# EAGLE design gerrit_lamp (EAGLE 8.7.1)
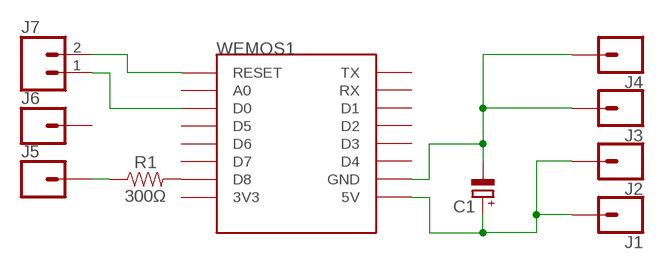
[diagram p0: schematic, sheet 1]

## Parts
C1  CPOL-EUE5-5  [E5-5]
J1  CONN_01PTH_NO_SILK_KIT  [1X01NS_KIT]
J2  CONN_01PTH_NO_SILK_KIT  [1X01NS_KIT]
J3  CONN_01PTH_NO_SILK_KIT  [1X01NS_KIT]
J4  CONN_01PTH_NO_SILK_KIT  [1X01NS_KIT]
J5  CONN_01PTH_NO_SILK_KIT  [1X01NS_KIT]
J6  CONN_01PTH_NO_SILK_KIT  [1X01NS_KIT]
J7  CONN_02  [1X02]
R1  300Ω  RESISTORAXIAL-0.3  [AXIAL-0.3]
WEMOS1  WEMOS-D1-MINI  [WEMOS-D1-MINI]

## Nets
D0: J7.1 WEMOS1.D0
GND: C1.- J3.1 J4.1 WEMOS1.GND
N$1: R1.P$2 WEMOS1.D8
N$6: J5.1 R1.P$1
RST: J7.2 WEMOS1.RESET
VCC: C1.+ J1.1 J2.1 WEMOS1.5V
Unconnected: J6.1 WEMOS1.3V3 WEMOS1.A0 WEMOS1.D1 WEMOS1.D2 WEMOS1.D3 WEMOS1.D4 WEMOS1.D5 WEMOS1.D6 WEMOS1.D7 WEMOS1.RX WEMOS1.TX

## Library data of the parts
C1 = rcl:CPOL-EU: POLARIZED CAPACITOR, European symbol; SPICEPREFIX: C
J1-J6 = SparkFun-Connectors:CONN_01: Single connection point. Often used as Generic Header-pin footprint for 0.1 inch spaced/style header connections On any of the 0.1 inch spaced packages, you can populate with these: Break Away Headers - Straight <https://www.sparkfun.com/products/116> (PRT-00116) Break Away Male Headers - Right Angle <https://www.sparkfun.com/products/553> (PRT-00553) Female Headers <https://www.sparkfun.com/products/115> (PRT-00115) Break Away Headers - Machine Pin <https://www.sparkfun.com/products/117> (PRT-00117) Break Away Female Headers - Swiss Machine Pin <https://www.sparkfun.com/products/743> (PRT-00743) This device is also useful as a general connection point to wire up your design to another part of your project. Our various solder wires solder well into these plated through hole pads. Hook-Up Wire - Assortment (Stranded, 22 AWG) <https://www.sparkfun.com/products/11375> (PRT-11375) Hook-Up Wire - Assortment (Solid Core, 22 AWG) <https://www.sparkfun.com/products/11367> (PRT-11367) View the entire wire category on our website here <https://www.sparkfun.com/categories/141> Special notes: SMTSO-256-ET is a "flush mount" nut for a 4-40 screw. We mostly use this on specialty testbeds; it is a nice way to connect hardware to your PCB at an adjustable hieght. Also note, the SNAP packages are for using a snappable style connector. We sell a baggie of snaps and they are also used on two LilyPad designs: Snap Assortment - 30 pack (male and female) <https://www.sparkfun.com/products/11347> (DEV-11347) LilyPad Arduino SimpleSnap <https://www.sparkfun.com/products/10941> (DEV-10941) LilyPad SimpleSnap Protoboard <https://www.sparkfun.com/products/10940> (DEV-10940)
J7 = SparkFun-Connectors:CONN_02: Multi connection point. Often used as Generic Header-pin footprint for 0.1 inch spaced/style header connections On any of the 0.1 inch spaced packages, you can populate with these: Break Away Headers - Straight <https://www.sparkfun.com/products/116> (PRT-00116) Break Away Male Headers - Right Angle <https://www.sparkfun.com/products/553> (PRT-00553) Female Headers <https://www.sparkfun.com/products/115> (PRT-00115) Break Away Headers - Machine Pin <https://www.sparkfun.com/products/117> (PRT-00117) Break Away Female Headers - Swiss Machine Pin <https://www.sparkfun.com/products/743> (PRT-00743) For SCREWTERMINALS and SPRING TERMINALS visit here: Screw Terimnals on SparkFun.com <https://www.sparkfun.com/search/results?term=Screw+Terminals> (5mm/3.5mm/2.54mm spacing) This device is also useful as a general connection point to wire up your design to another part of your project. Our various solder wires solder well into these plated through hole pads. Hook-Up Wire - Assortment (Stranded, 22 AWG) <https://www.sparkfun.com/products/11375> (PRT-11375) Hook-Up Wire - Assortment (Solid Core, 22 AWG) <https://www.sparkfun.com/products/11367> (PRT-11367) View the entire wire category on our website here <https://www.sparkfun.com/categories/141> Special notes: Molex polarized connector foot print use with: PRT-08233 with associated crimp pins and housings. 2.54_SCREWTERM for use with PRT-10571. 3.5mm Screw Terminal footprints for PRT-08084 5mm Screw Terminal footprints for use with PRT-08432
R1 = SparkFun-Resistors:RESISTOR: Generic Resistor Package
WEMOS1 = esp8266modules:WEMOS-D1-MINI: WeMos.cc D1 mini ESP8266 module

## Board
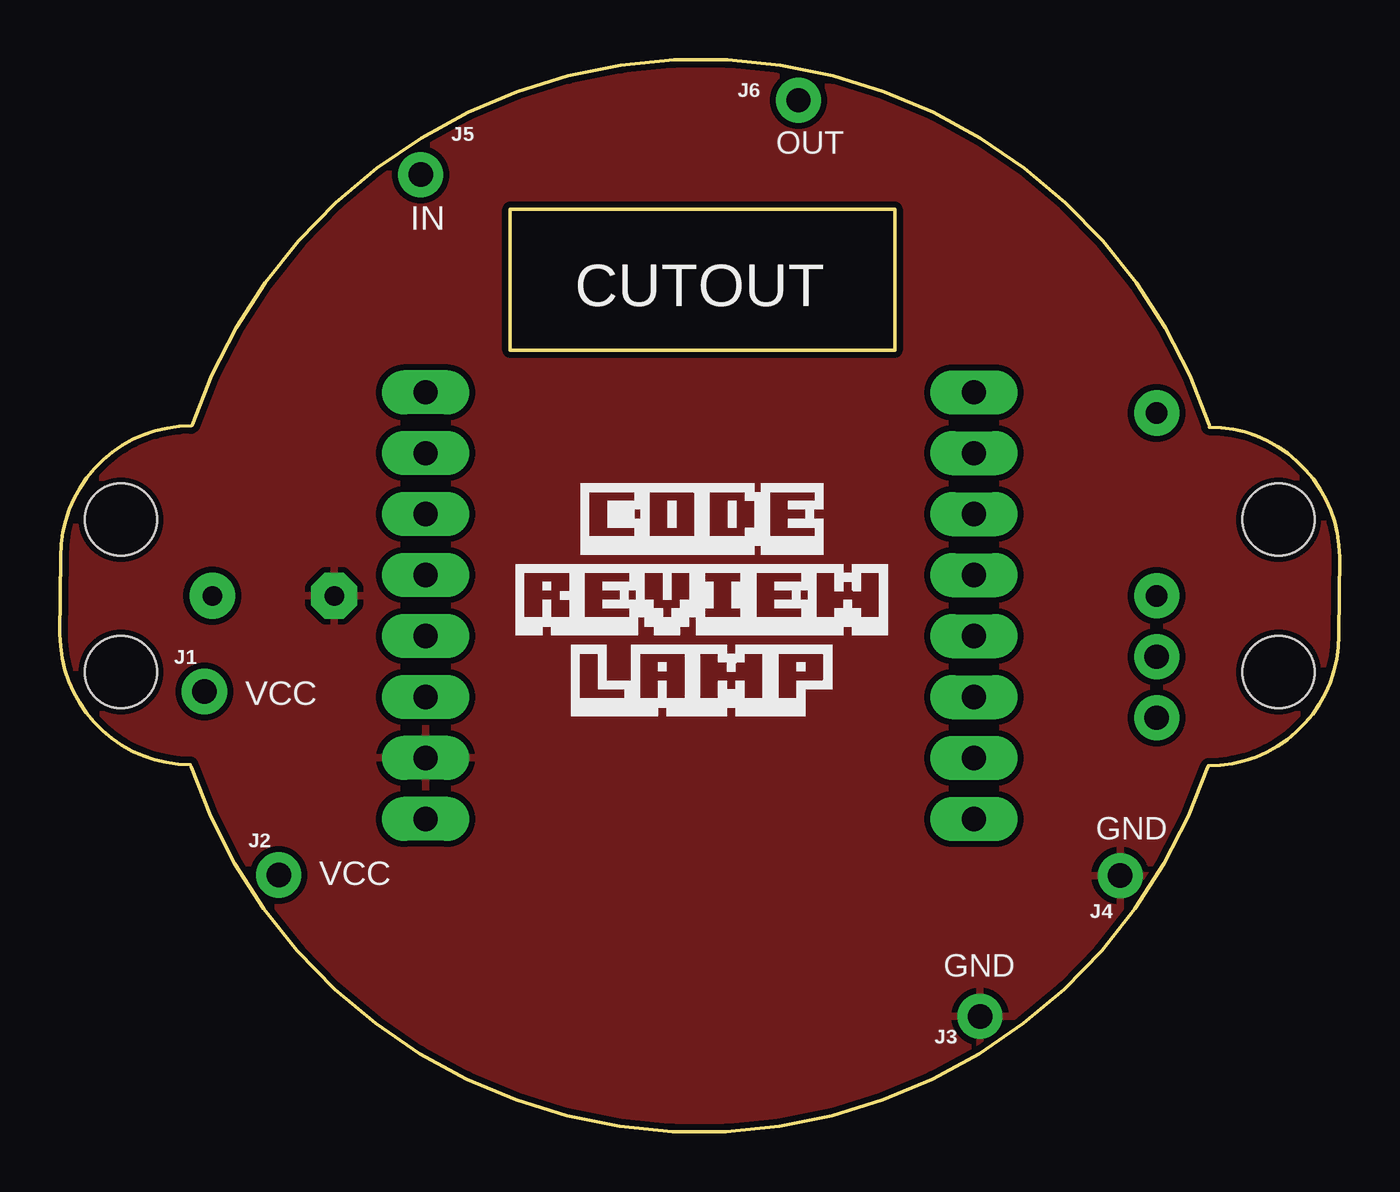
[diagram p1: board, top side]
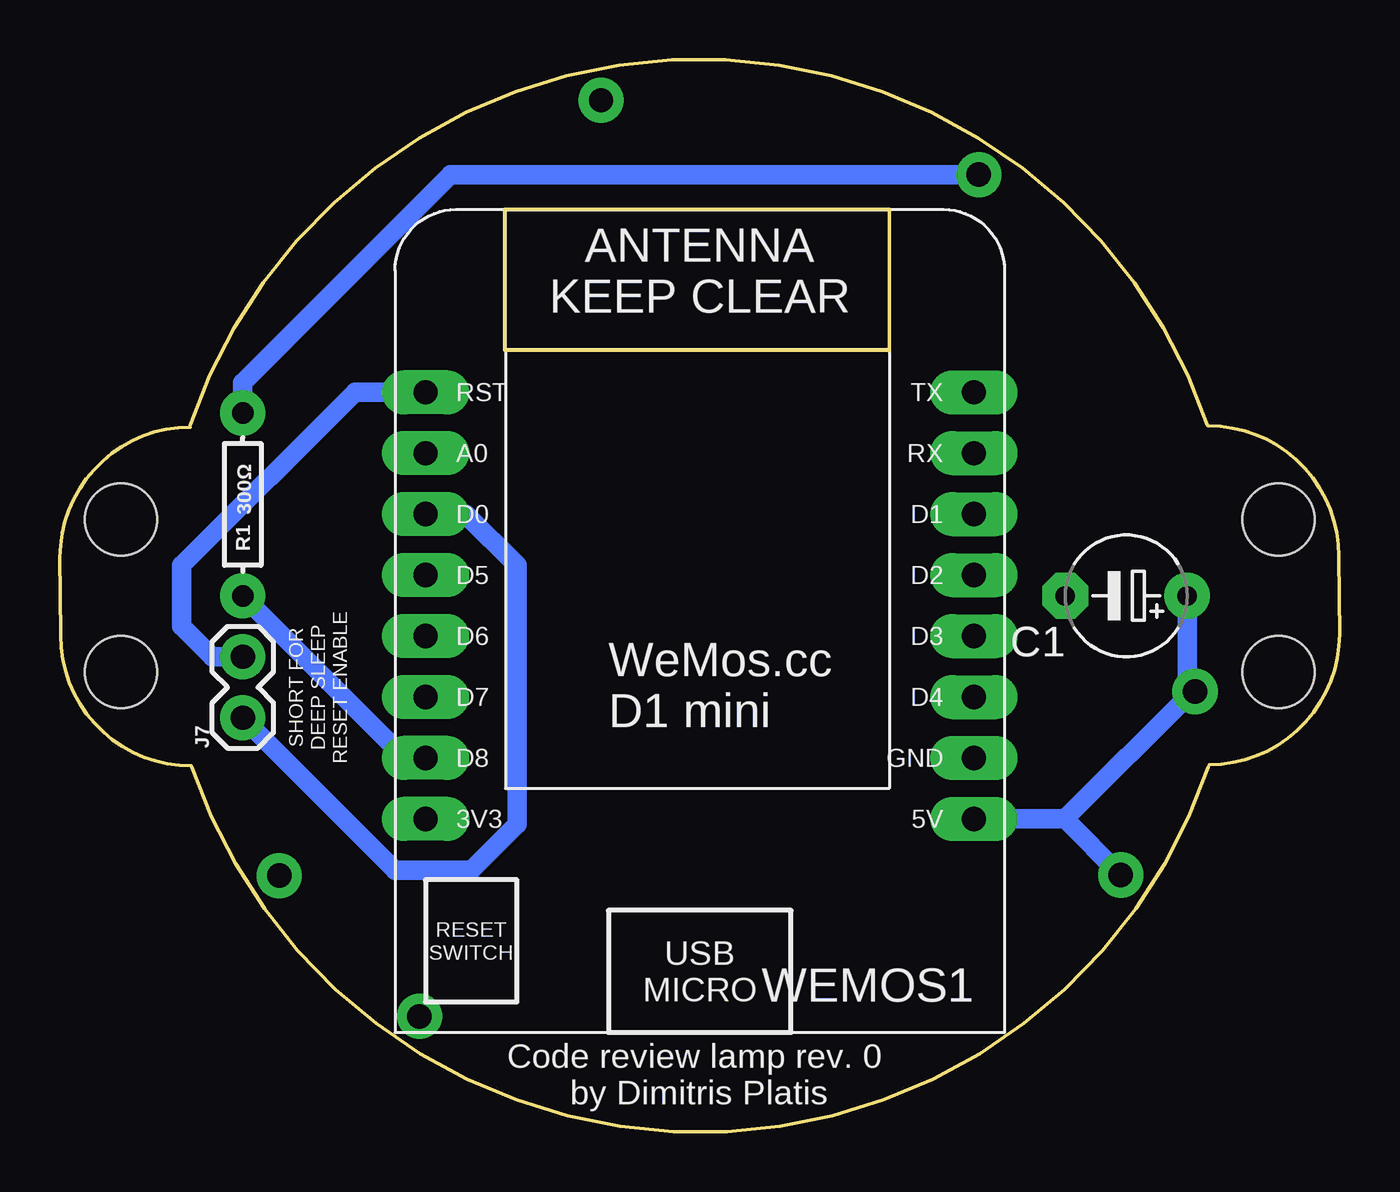
[diagram p2: board, bottom side, seen from below]

Size 53.34 x 44.66 mm. Coordinates in mm from the lower left corner, seen from the top.
Outline: 18.8,38.43 34.8,38.43 34.8,32.57 18.77,32.57 18.77,38.43
Outline: 47.9,29.44 arc143 5.51,29.44
Outline: 5.46,29.42 arc90 0.02,23.98
Outline: 0.02,23.93 0,20.7
Outline: 47.9,29.37 arc-90 53.34,23.93
Outline: 53.31,20.73 53.34,23.96
Outline: 5.46,15.22 arc143 47.85,15.22
Outline: 47.88,15.24 arc90 53.31,20.68
Outline: 5.44,15.29 arc-90 0,20.73
Copper layers (1*16): Top 0.035mm / dielectric 1.5mm / Bottom 0.035mm
Design rules "SeeedStudio_2layer_DRU_no_angle_20140221": minimum track width 6mil, minimum drill 12mil, track to track 6mil, track to pad 6mil, pad to pad 6mil, via to via 6mil, smd to smd 0mil, copper to edge 10mil, drill to drill 10mil, minimum pad ring 10mil, minimum via ring 6mil, stop-mask expansion 2mil, vias tented up to drill 100mil, thermal gap 10mil
Holes 3 mm at 2.54,25.5 2.54,19.15 50.8,25.5 50.8,19.15
Milling: 4 lines

### Footprints (pad centres in the part's own frame; a part is rotated, then mirrored left to right if it is on the bottom)
E5-5 = drill 0.813 pad 1.905: + -2.54,0 | drill 0.813 pad 1.905 octagon: - 2.54,0
1X01NS_KIT = drill 1.016 pad 1.88: 1 0,0
1X02 = drill 1.016 pad 1.88: 1 0,0; 2 2.54,0
AXIAL-0.3 = drill 0.9 pad 1.88: P$1 -3.81,0; P$2 3.81,0
WEMOS-D1-MINI = drill 1.016 pad 1.829 long: 3V3 -10.16,-10.16; 5V 12.7,-10.16; A0 -10.16,5.08; D0 -10.16,2.54; D1 12.7,2.54; D2 12.7,0; D3 12.7,-2.54; D4 12.7,-5.08; D5 -10.16,0; D6 -10.16,-2.54; D7 -10.16,-5.08; D8 -10.16,-7.62; GND 12.7,-7.62; RESET -10.16,7.62; RX 12.7,5.08; TX 12.7,7.62

### Placement (x,y rotation side)
C1  8.89,22.33 180 bottom
J1  6.02,18.34 0 top
J2  9.12,10.7 0 top
J3  38.35,4.8 0 top
J4  44.2,10.67 0 top
J5  15.04,39.88 0 top
J6  30.78,42.98 0 top
J7  45.72,17.25 90 bottom
R1  45.72,26.14 270 bottom
WEMOS1  27.94,23.19 0 bottom

### Tracks (layer width: path | path; a pad name or v marks a point on that pad's centre or on a via)
D0
  Bottom 0.813: J7.1 39.37,10.9 36.2,10.9 34.29,12.8 34.29,23.6 36.42,25.73 WEMOS1.D0
GND
  pour Top (isolate 0.254): -1.27,46.46 54.61,46.46 54.61,-1.8 -1.27,-1.8
N$1
  Bottom 0.813: R1.P$2 38.96,15.57 WEMOS1.D8
N$6
  Bottom 0.813: J5.1 37.06,39.88 45.72,31.22 R1.P$1
RST
  Bottom 0.813: WEMOS1.RESET 41.05,30.81 48.26,23.6 48.26,21.06 46.99,19.79 J7.2
VCC
  Bottom 0.813: WEMOS1.5V 11.45,13.03 | 11.45,13.03 J2.1 | 11.45,13.03 6.15,18.34 J1.1 6.35,18.67 C1.+

### Text on the board
tPlace: OUT | IN | CUTOUT | VCC | GND | VCC | GND
bPlace: SHORT FOR / DEEP SLEEP / RESET ENABLE | Code review lamp rev. 0 / by Dimitris Platis